# Altium schematic sheet config-bank3.SchDoc: Config FPGA - Bank 3
size Legal; CheckedBy: J. Brinton; CompanyName: Signal Laboratories, Inc.; DrawnBy: J. Brinton; Engineer: J. Brinton; Address1: 3479 Edison Way; Address2: Menlo Park CA 94025; Address3: +1 (877) 778-8435; Address4: siglabs.com; DocumentNumber: 15; Revision: 2b; SheetNumber: 16; SheetTotal: 58
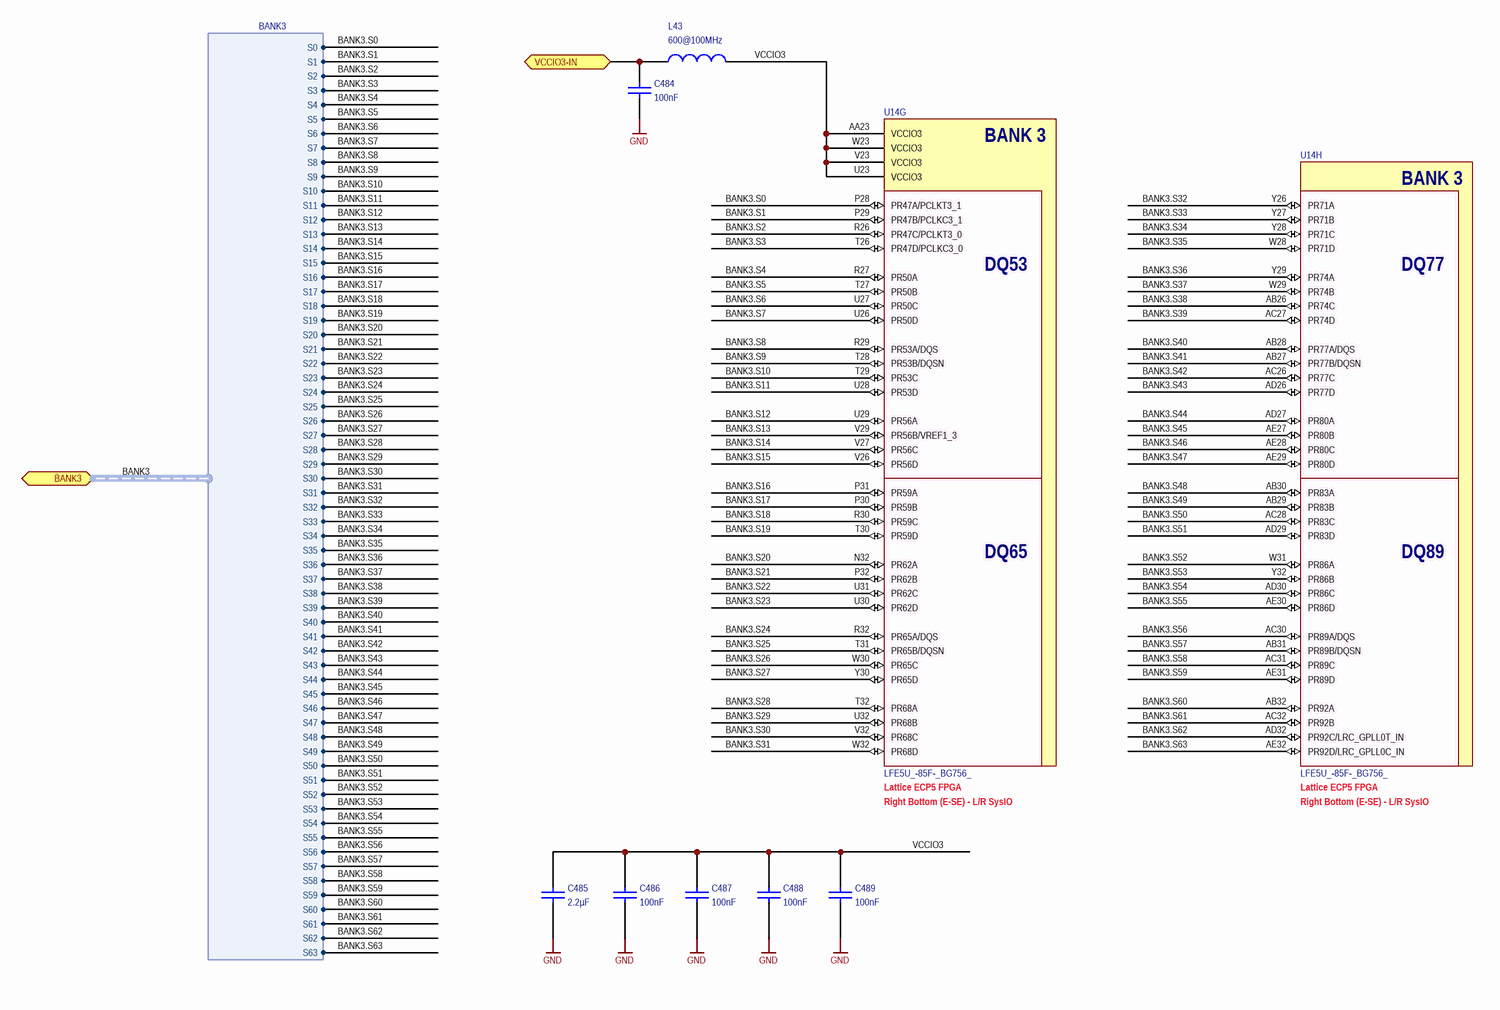
[diagram p0: config-bank3.SchDoc]

## Parts
C484  value 100nF  [CAPC1005X56N]  (hidden comment: GRM155R71C104KA88J)
C485  value 2.2µF  [CAPC1608X90N]  (hidden comment: GRM21BR71C225KA12L)
C486  value 100nF  [CAPC1005X56N]  (hidden comment: GRM155R71C104KA88J)
C487  value 100nF  [CAPC1005X56N]  (hidden comment: GRM155R71C104KA88J)
C488  value 100nF  [CAPC1005X56N]  (hidden comment: GRM155R71C104KA88J)
C489  value 100nF  [CAPC1005X56N]  (hidden comment: GRM155R71C104KA88J)
L43  value 600@100MHz  [0402]  (hidden comment: BLM15PX601SN1D)
U14  LFE5U_-85F-_BG756_  [caBGA756]  (parts G,H of 19)

## Ports
BANK3 (harness BANK3), VCCIO3-IN

## Harnesses
BANK3: S0, S1, S2, S3, S4, S5, S6, S7, S8, S9, S10, S11, S12, S13, S14, S15, S16, S17, S18, S19, S20, S21, S22, S23, S24, S25, S26, S27, S28, S29, S30, S31, S32, S33, S34, S35, S36, S37, S38, S39, S40, S41, S42, S43, S44, S45, S46, S47, S48, S49, S50, S51, S52, S53, S54, S55, S56, S57, S58, S59, S60, S61, S62, S63

## Nets
GND: C484.1 C485.1 C486.1 C487.1 C488.1 C489.1
BANK3.S0: U14.P28(PR47A/PCLKT3_1) ; port BANK3.S0
BANK3.S1: U14.P29(PR47B/PCLKC3_1) ; port BANK3.S1
BANK3.S2: U14.R26(PR47C/PCLKT3_0) ; port BANK3.S2
BANK3.S3: U14.T26(PR47D/PCLKC3_0) ; port BANK3.S3
BANK3.S4: U14.R27(PR50A) ; port BANK3.S4
BANK3.S5: U14.T27(PR50B) ; port BANK3.S5
BANK3.S6: U14.U27(PR50C) ; port BANK3.S6
BANK3.S7: U14.U26(PR50D) ; port BANK3.S7
BANK3.S8: U14.R29(PR53A/DQS) ; port BANK3.S8
BANK3.S9: U14.T28(PR53B/DQSN) ; port BANK3.S9
BANK3.S10: U14.T29(PR53C) ; port BANK3.S10
BANK3.S11: U14.U28(PR53D) ; port BANK3.S11
BANK3.S12: U14.U29(PR56A) ; port BANK3.S12
BANK3.S13: U14.V29(PR56B/VREF1_3) ; port BANK3.S13
BANK3.S14: U14.V27(PR56C) ; port BANK3.S14
BANK3.S15: U14.V26(PR56D) ; port BANK3.S15
BANK3.S16: U14.P31(PR59A) ; port BANK3.S16
BANK3.S17: U14.P30(PR59B) ; port BANK3.S17
BANK3.S18: U14.R30(PR59C) ; port BANK3.S18
BANK3.S19: U14.T30(PR59D) ; port BANK3.S19
BANK3.S20: U14.N32(PR62A) ; port BANK3.S20
BANK3.S21: U14.P32(PR62B) ; port BANK3.S21
BANK3.S22: U14.U31(PR62C) ; port BANK3.S22
BANK3.S23: U14.U30(PR62D) ; port BANK3.S23
BANK3.S24: U14.R32(PR65A/DQS) ; port BANK3.S24
BANK3.S25: U14.T31(PR65B/DQSN) ; port BANK3.S25
BANK3.S26: U14.W30(PR65C) ; port BANK3.S26
BANK3.S27: U14.Y30(PR65D) ; port BANK3.S27
BANK3.S28: U14.T32(PR68A) ; port BANK3.S28
BANK3.S29: U14.U32(PR68B) ; port BANK3.S29
BANK3.S30: U14.V32(PR68C) ; port BANK3.S30
BANK3.S31: U14.W32(PR68D) ; port BANK3.S31
BANK3.S32: U14.Y26(PR71A) ; port BANK3.S32
BANK3.S33: U14.Y27(PR71B) ; port BANK3.S33
BANK3.S34: U14.Y28(PR71C) ; port BANK3.S34
BANK3.S35: U14.W28(PR71D) ; port BANK3.S35
BANK3.S36: U14.Y29(PR74A) ; port BANK3.S36
BANK3.S37: U14.W29(PR74B) ; port BANK3.S37
BANK3.S38: U14.AB26(PR74C) ; port BANK3.S38
BANK3.S39: U14.AC27(PR74D) ; port BANK3.S39
BANK3.S40: U14.AB28(PR77A/DQS) ; port BANK3.S40
BANK3.S41: U14.AB27(PR77B/DQSN) ; port BANK3.S41
BANK3.S42: U14.AC26(PR77C) ; port BANK3.S42
BANK3.S43: U14.AD26(PR77D) ; port BANK3.S43
BANK3.S44: U14.AD27(PR80A) ; port BANK3.S44
BANK3.S45: U14.AE27(PR80B) ; port BANK3.S45
BANK3.S46: U14.AE28(PR80C) ; port BANK3.S46
BANK3.S47: U14.AE29(PR80D) ; port BANK3.S47
BANK3.S48: U14.AB30(PR83A) ; port BANK3.S48
BANK3.S49: U14.AB29(PR83B) ; port BANK3.S49
BANK3.S50: U14.AC28(PR83C) ; port BANK3.S50
BANK3.S51: U14.AD29(PR83D) ; port BANK3.S51
BANK3.S52: U14.W31(PR86A) ; port BANK3.S52
BANK3.S53: U14.Y32(PR86B) ; port BANK3.S53
BANK3.S54: U14.AD30(PR86C) ; port BANK3.S54
BANK3.S55: U14.AE30(PR86D) ; port BANK3.S55
BANK3.S56: U14.AC30(PR89A/DQS) ; port BANK3.S56
BANK3.S57: U14.AB31(PR89B/DQSN) ; port BANK3.S57
BANK3.S58: U14.AC31(PR89C) ; port BANK3.S58
BANK3.S59: U14.AE31(PR89D) ; port BANK3.S59
BANK3.S60: U14.AB32(PR92A) ; port BANK3.S60
BANK3.S61: U14.AC32(PR92B) ; port BANK3.S61
BANK3.S62: U14.AD32(PR92C/LRC_GPLL0T_IN) ; port BANK3.S62
BANK3.S63: U14.AE32(PR92D/LRC_GPLL0C_IN) ; port BANK3.S63
VCCIO3: C485.2 C486.2 C487.2 C488.2 C489.2 L43.1 U14.AA23(VCCIO3) U14.U23(VCCIO3) U14.V23(VCCIO3) U14.W23(VCCIO3)
VCCIO3-IN: C484.2 L43.2 ; port VCCIO3-IN

## Buses and harness runs
harness BANK3 = port BANK3

## Notes on the sheet
- (near U14) Right Bottom (E-SE) - L/R SysIO
- (near U14) Lattice ECP5 FPGA
- Title
- Engineer
- Revision
- Drawn By
- Checked By
- Date
- Sheet
- of
- (in symbol LFE5U_-85F-_BG756_, part G) BANK 3; DQ53; DQ65
- (in symbol LFE5U_-85F-_BG756_, part H) BANK 3; DQ77; DQ89

## Library data of the parts
C484 C486-C489 = GRM155R71A104KA01J: Ceramic Capacitor 100nF ±10% 16V X7R 0402; Manufacturer: Murata; Tr: -55:125; Manufacturer P/N: GRM155R71C104KA88J; Tolerance: ±10%; Package: 0402; Voltage: 16V
C485 = GRM188R71A225KE15D: Ceramic Capacitor 2.2uF ±10% 10V X7R 0603; Manufacturer: Murata; Tr: -55:125; Manufacturer P/N: GRM188R71A225KE15D; Tolerance: ±10%; Package: 0603; Voltage: 10V
L43 = IND 0402: Ferrite Bead 600-Ohm @ 100MHz 900mA 0402; Manufacturer: Murata; Tolerance: ±25%; Tr: -55:125; Manufacturer P/N: BLM15PX601SN1D; Package: 0402
U14 = LFE5U_-85F-_BG756_: ECP5 FPGA, 85k LUT, 756-caBGA; Manufacturer: Lattice Semiconductor; Manufacturer P/N: LFE5U_-85F-_BG756_